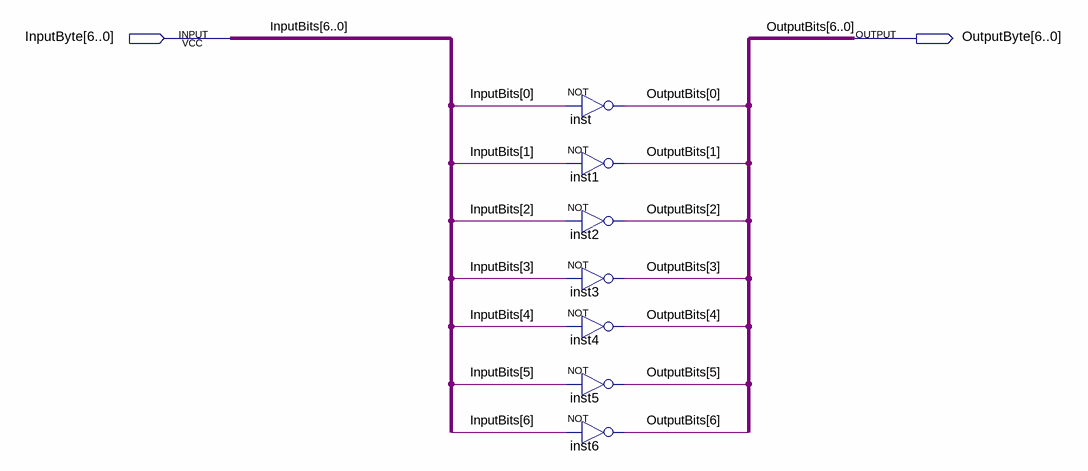
[diagram p0: schematic sheet]
// Quartus schematic BusNot.bdf as structural Verilog: 7 symbols, 2 pins
module BusNot (
  input  [6:0] InputByte,
  output [6:0] OutputByte
);

  not inst (OutputByte[0], InputByte[0]);
  not inst1 (OutputByte[1], InputByte[1]);
  not inst2 (OutputByte[2], InputByte[2]);
  not inst3 (OutputByte[3], InputByte[3]);
  not inst4 (OutputByte[4], InputByte[4]);
  not inst5 (OutputByte[5], InputByte[5]);
  not inst6 (OutputByte[6], InputByte[6]);

  // Other names for the same wires on the sheet: InputBits[6:0] = InputByte; OutputBits[6:0] = OutputByte
endmodule
